# EAGLE design new board (EAGLE 9.5.0)
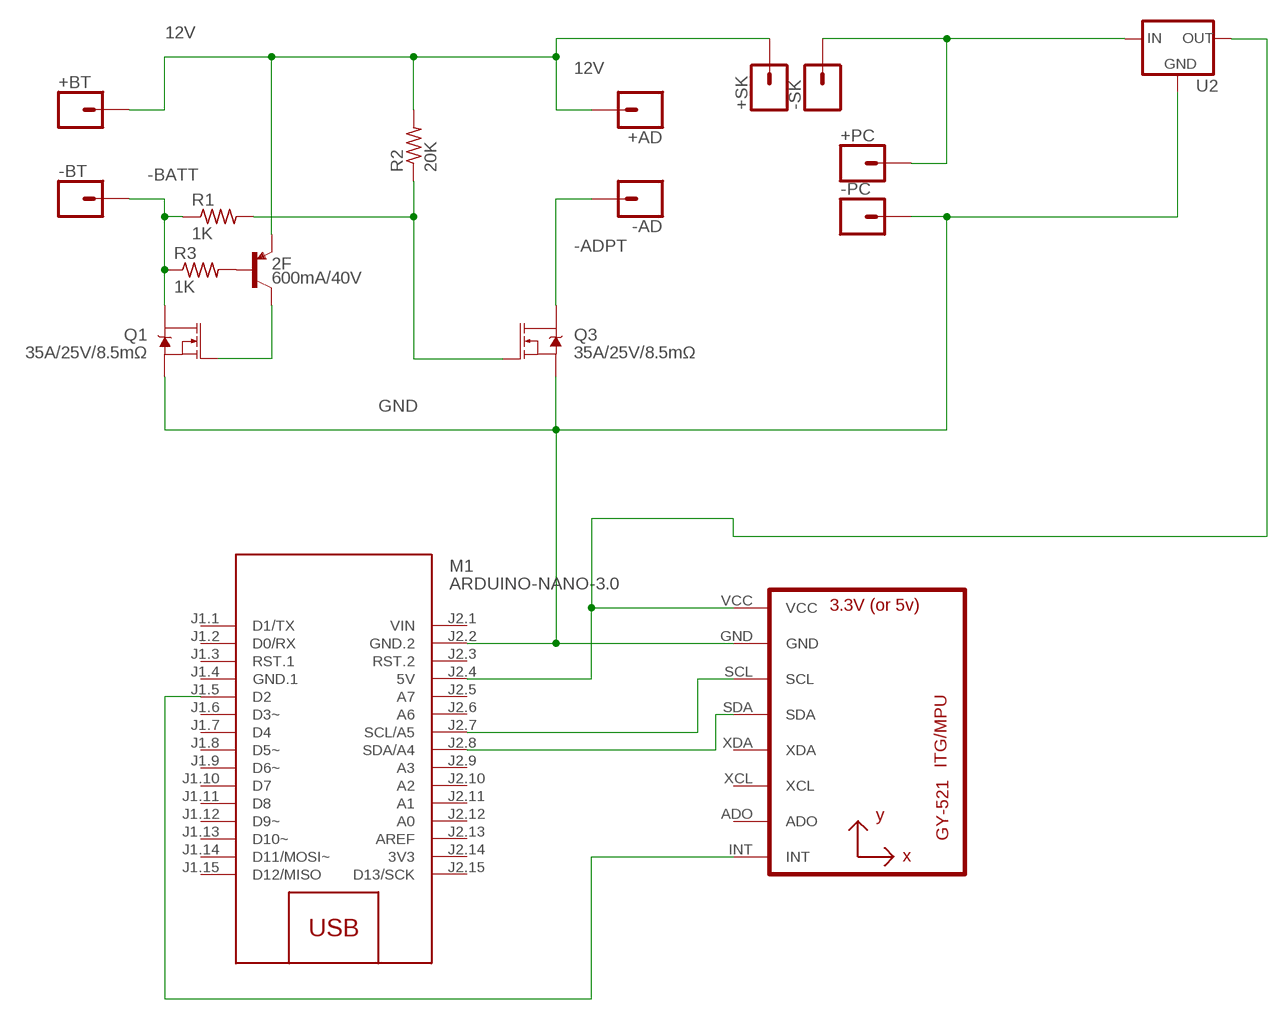
[diagram p0: schematic, sheet 1]

## Parts
2F  600mA/40V  TRANS_PNP-MMBT4403  [SOT23-3]
+AD  CONN_01PTH_2MM  [1X01_2MM]
+BT  CONN_01PTH_2MM  [1X01_2MM]
+PC  CONN_01PTH_2MM  [1X01_2MM]
+SK  CONN_01PTH_2MM  [1X01_2MM]
-AD  CONN_01PTH_2MM  [1X01_2MM]
-BT  CONN_01PTH_2MM  [1X01_2MM]
-PC  CONN_01PTH_2MM  [1X01_2MM]
-SK  CONN_01PTH_2MM  [1X01_2MM]
M1  ARDUINO-NANO-3.0  [ARDUINO-NANO-3.0]
Q1  35A/25V/8.5mΩ  MOSFET-NCH-FDD8780  [DPAK]
Q3  35A/25V/8.5mΩ  MOSFET-NCH-FDD8780  [DPAK]
R1  1K  R-US_M1206  [M1206]
R2  20K  R-US_M1206  [M1206]
R3  1K  R-US_M1206  [M1206]
U1  GY-521MPU6050  [GY-521]
U2  +12v  V_REG_78XX7812  [TO-252]

## Nets
12V: 2F.2(E) +AD.1 +BT.1 +SK.1 R2.2
-ADPT: -AD.1 Q3.4(D)
-BATT: -BT.1 Q1.4(D) R1.1 R3.1
GND: -PC.1 M1.J2.2(GND.2) Q1.3(S) Q3.3(S) U1.GND U2.3(GND)
N$1: 2F.3(C) Q1.1(G)
N$2: +PC.1 -SK.1 U2.1(IN)
N$3: Q3.1(G) R1.2 R2.1
N$4: M1.J2.4(5V) U1.VCC U2.2(OUT)
N$6: M1.J2.8(SDA/A4) U1.SDA
N$7: M1.J2.7(SCL/A5) U1.SCL
N$8: M1.J1.5(D2) U1.INT
N$14: 2F.1(B) R3.2
Unconnected: M1.J1.1(D1/TX) M1.J1.2(D0/RX) M1.J1.3(RST.1) M1.J1.6(D3~) M1.J1.7(D4) M1.J1.8(D5~) M1.J1.9(D6~) M1.J1.10(D7) M1.J1.11(D8) M1.J1.12(D9~) M1.J1.13(D10~) M1.J1.14(D11/MOSI~) M1.J1.15(D12/MISO) M1.J2.3(RST.2) M1.J2.5(A7) M1.J2.6(A6) M1.J2.9(A3) M1.J2.10(A2) M1.J2.11(A1) M1.J2.12(A0) M1.J2.13(AREF) M1.J2.15(D13/SCK) U1.ADO U1.XCL U1.XDA

## Power pins joined to a net without a drawn wire
3V3: M1.J2.14(3V3)
GND.1: M1.J1.4(GND.1)
VIN: M1.J2.1(VIN)

## Library data of the parts
2F = SparkFun-DiscreteSemi:TRANS_PNP: PNP transistor Current controlled devices typically used to amplify current or used as a switch. SparkFun Products: SparkFun Serial Enabled 16x2 LCD - Red on Black <https://www.sparkfun.com/products/9068> SparkFun Logomatic <https://www.sparkfun.com/products/12772>; PROD_ID: TRANS-09245
+AD +BT +PC +SK -AD -BT -PC -SK = SparkFun-Connectors:CONN_01: Single connection point. Often used as Generic Header-pin footprint for 0.1 inch spaced/style header connections On any of the 0.1 inch spaced packages, you can populate with these: Break Away Headers - Straight <https://www.sparkfun.com/products/116> (PRT-00116) Break Away Male Headers - Right Angle <https://www.sparkfun.com/products/553> (PRT-00553) Female Headers <https://www.sparkfun.com/products/115> (PRT-00115) Break Away Headers - Machine Pin <https://www.sparkfun.com/products/117> (PRT-00117) Break Away Female Headers - Swiss Machine Pin <https://www.sparkfun.com/products/743> (PRT-00743) This device is also useful as a general connection point to wire up your design to another part of your project. Our various solder wires solder well into these plated through hole pads. Hook-Up Wire - Assortment (Stranded, 22 AWG) <https://www.sparkfun.com/products/11375> (PRT-11375) Hook-Up Wire - Assortment (Solid Core, 22 AWG) <https://www.sparkfun.com/products/11367> (PRT-11367) View the entire wire category on our website here <https://www.sparkfun.com/categories/141> Special notes: SMTSO-256-ET is a "flush mount" nut for a 4-40 screw. We mostly use this on specialty testbeds; it is a nice way to connect hardware to your PCB at an adjustable hieght. Also note, the SNAP packages are for using a snappable style connector. We sell a baggie of snaps and they are also used on two LilyPad designs: Snap Assortment - 30 pack (male and female) <https://www.sparkfun.com/products/11347> (DEV-11347) LilyPad Arduino SimpleSnap <https://www.sparkfun.com/products/10941> (DEV-10941) LilyPad SimpleSnap Protoboard <https://www.sparkfun.com/products/10940> (DEV-10940)
M1 = diy-modules:ARDUINO-NANO-3.0: Arduino Nano 3.0 and compatible devices More details available here: https://www.arduino.cc/en/Main/ArduinoBoardNano Click here to find device on ebay.com <http://www.ebay.com/sch/arduino+nano>
Q1 Q3 = SparkFun-DiscreteSemi:MOSFET-NCH: N-channel MOSFETs Voltage controlled devices that allow control of high current outputs. SparkFun Products: SparkFun OpenScale <https://www.sparkfun.com/products/13261> SparkFun Digital Sandbox <https://www.sparkfun.com/products/12651> SparkFun Monster Moto Shield <https://www.sparkfun.com/products/10182> SparkFun MOSFET Power Controller <https://www.sparkfun.com/products/11214>; PROD_ID: TRANS-09984
R1-R3 = rcl:R-US_: RESISTOR, American symbol; SPICEPREFIX: R
U1 = gy-521:GY-521
U2 = SparkFun-IC-Power:V_REG_78XX: Voltage Regulator Standard 78xx regulator. IGO (Input Ground Output). Spark Fun Electronics SKU : COM-00107; PROD_ID: VREG-12370

## Board
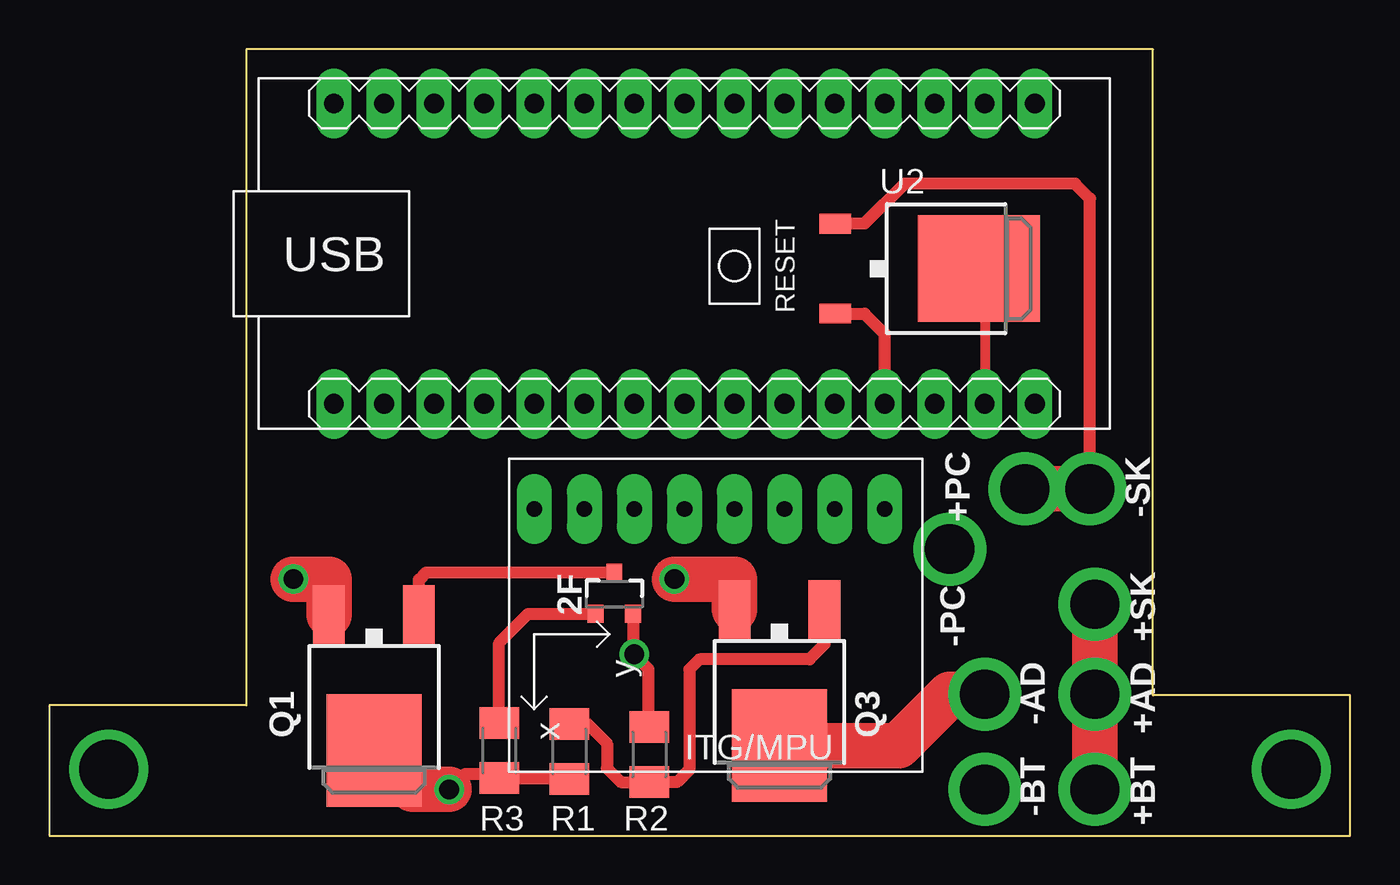
[diagram p1: board, top side]
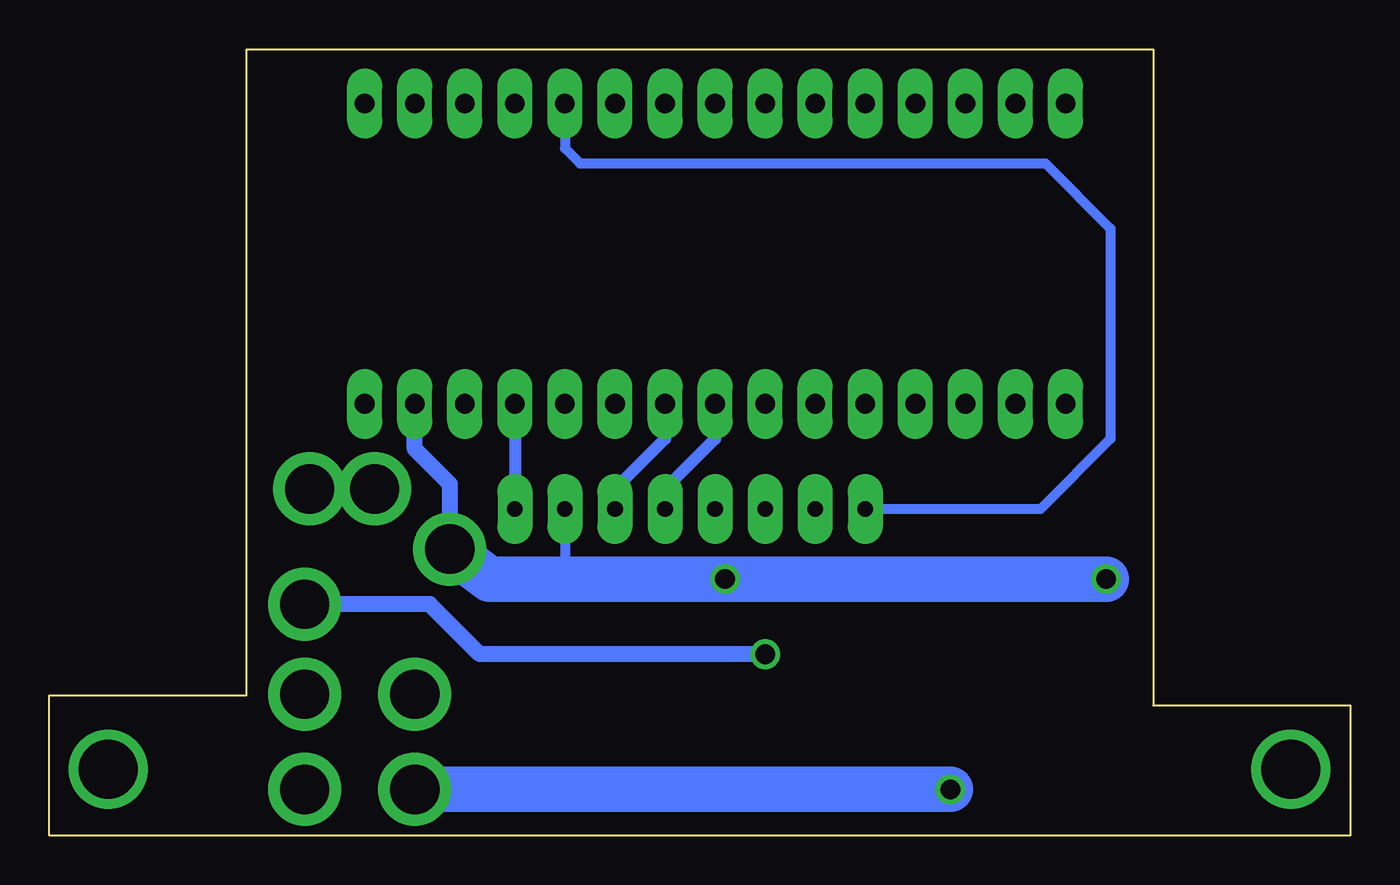
[diagram p2: board, bottom side, seen from below]

Size 66.01 x 39.88 mm. Coordinates in mm from the lower left corner, seen from the top.
Outline: 10.38,0 55.38,0
Outline: 10,6.6 0,6.6 0,0 66.01,0 66,7.11 56,7.11 56,39.88 10,39.88 10,6.6
Copper layers (1*16): Top 0.035mm / dielectric 1.5mm / Bottom 0.035mm
Design rules "default": minimum track width 6mil, minimum drill 0.35mm, track to track 24mil, track to pad 24mil, pad to pad 24mil, via to via 24mil, smd to smd 24mil, copper to edge 40mil, drill to drill 6mil, minimum pad ring 10mil, minimum via ring 8mil, stop-mask expansion 4mil, vias tented up to drill 0mil, thermal gap 10mil

### Footprints (pad centres in the part's own frame; a part is rotated, then mirrored left to right if it is on the bottom)
SOT23-3 = smd 0.8 x 0.9: 1 -0.95,-1; 2 0.95,-1; 3 0,1.1
1X01_2MM = drill 2.5 pad 3.702: 1 0,0
ARDUINO-NANO-3.0 = drill 1 pad 1.778 long: J1.1 17.78,7.62; J1.2 15.24,7.62; J1.3 12.7,7.62; J1.4 10.16,7.62; J1.5 7.62,7.62; J1.6 5.08,7.62; J1.7 2.54,7.62; J1.8 0,7.62; J1.9 -2.54,7.62; J1.10 -5.08,7.62; J1.11 -7.62,7.62; J1.12 -10.16,7.62; J1.13 -12.7,7.62; J1.14 -15.24,7.62; J1.15 -17.78,7.62; J2.1 17.78,-7.62; J2.2 15.24,-7.62; J2.3 12.7,-7.62; J2.4 10.16,-7.62; J2.5 7.62,-7.62; J2.6 5.08,-7.62; J2.7 2.54,-7.62; J2.8 0,-7.62; J2.9 -2.54,-7.62; J2.10 -5.08,-7.62; J2.11 -7.62,-7.62; J2.12 -10.16,-7.62; J2.13 -12.7,-7.62; J2.14 -15.24,-7.62; J2.15 -17.78,-7.62
DPAK = smd 1.6 x 3: 1 -2.28,-5.31; 3 2.28,-5.31 | smd 4.826 x 5.715: 4 0,1.588
M1206 = smd 1.6 x 2: 1 -1.4,0; 2 1.4,0
GY-521 = drill 0.8 pad 1.778 long: ADO -8.89,-6.35; GND -8.89,6.35; INT -8.89,-8.89; SCL -8.89,3.81; SDA -8.89,1.27; VCC -8.89,8.89; XCL -8.89,-3.81; XDA -8.89,-1.27
TO-252 = smd 1 x 1.6: 1 -2.28,-4.8; 2 2.28,-4.8 | smd 5.4 x 6.2: 3 0,2.5

### Placement (x,y rotation side)
2F  28.67,12.24 0 top
+AD  53.05,7.16 270 top
+BT  53.05,2.34 270 top
+PC  49.5,17.58 270 top
+SK  53.05,11.73 270 top
-AD  47.47,7.16 270 top
-BT  47.47,2.34 270 top
-PC  45.69,14.53 90 top
-SK  52.8,17.58 270 top
M1  32.23,29.51 0 top
Q1  16.48,5.89 180 top
Q3  37.05,6.15 180 top
R1  26.38,4.27 90 top
R2  30.45,4.11 90 top
R3  22.83,4.32 90 top
U1  33.5,7.67 270 top
U2  44.67,28.75 270 top

### Tracks (layer width: path | path; a pad name or v marks a point on that pad's centre or on a via)
12V  (via drill 1)
  Top 0.61: R2.2 30.38,5.52 30.38,8.45 29.62,9.21 2F.2 29.62,9.14 29.63,9.14 v29.69,9.2
  Top 2.3: +SK.1 +AD.1 +BT.1
  Bottom 0.813: v29.69,9.2 44.16,9.2 46.7,11.73 +SK.1
-ADPT
  Top 2.3: -AD.1 45.69,7.16 43.08,4.56 Q3.4
-BATT  (via drill 1)
  Top 0.61: 18.51,5.38 18.51,4.12 18.32,4.3 Q1.4 | Q1.4 16.48,1.83 | 16.48,5.71 Q1.4 | R1.1 22.88,2.87 R3.1 22.65,3.1 21.05,3.1 v20.29,2.34
  Top 2.3: v20.29,2.34 18.45,2.34 Q1.4
  Bottom 2.3: -BT.1 v20.29,2.34
GND  (via drill 1)
  Top 0.508: 47.47,28.46 M1.J2.2
  Top 0.61: U2.3 47.47,28.46 | Q3.3
  Top 2.3: v12.38,13.01 14.2,13.01 Q1.3 | v31.72,13.01 34.77,13.01 34.77,13 Q3.3
  Bottom 0.508: U1.GND 39.85,13.01
  Bottom 0.813: -PC.1 45.69,17.83 47.47,19.61 M1.J2.2
  Bottom 2.3: -PC.1 43.66,13.01 39.85,13.01 v31.72,13.01 v12.38,13.01
N$1
  Top 0.61: Q1.1 18.76,12.98 19.12,13.34 2F.3
N$2
  Top 0.61: -SK.1 52.8,32.31 52.04,33.07 43.4,33.07 41.36,31.03 U2.1
  Top 2.3: -SK.1 +PC.1
N$3
  Top 0.61: Q3.1 39.33,9.71 39.34,9.7 38.58,8.94 32.99,8.94 32.48,8.43 32.48,3.35 31.84,2.71 R2.1 29,2.71 28.3,3.42 28.3,4.69 27.32,5.67 R1.2
N$4
  Top 0.61: U2.2 41.36,26.47 42.39,25.45 M1.J2.4
  Bottom 0.61: M1.J2.4 U1.VCC
N$5  (via drill 3)
  other vias: 3.02,3.36
N$6
  Bottom 0.61: M1.J2.8 32.23,20.12 34.77,17.58 U1.SDA
N$7
  Bottom 0.61: M1.J2.7 34.77,20.12 37.31,17.58 U1.SCL
N$8
  Bottom 0.508: M1.J1.5 39.85,34.85 39.08,34.09 15.46,34.09 12.16,30.78 12.16,20.12 15.72,16.56 U1.INT
N$9  (via drill 3)
  other vias: 63.02,3.36
N$14
  Top 0.61: R3.2 22.83,9.78 23.66,10.6 24.29,11.24 2F.1